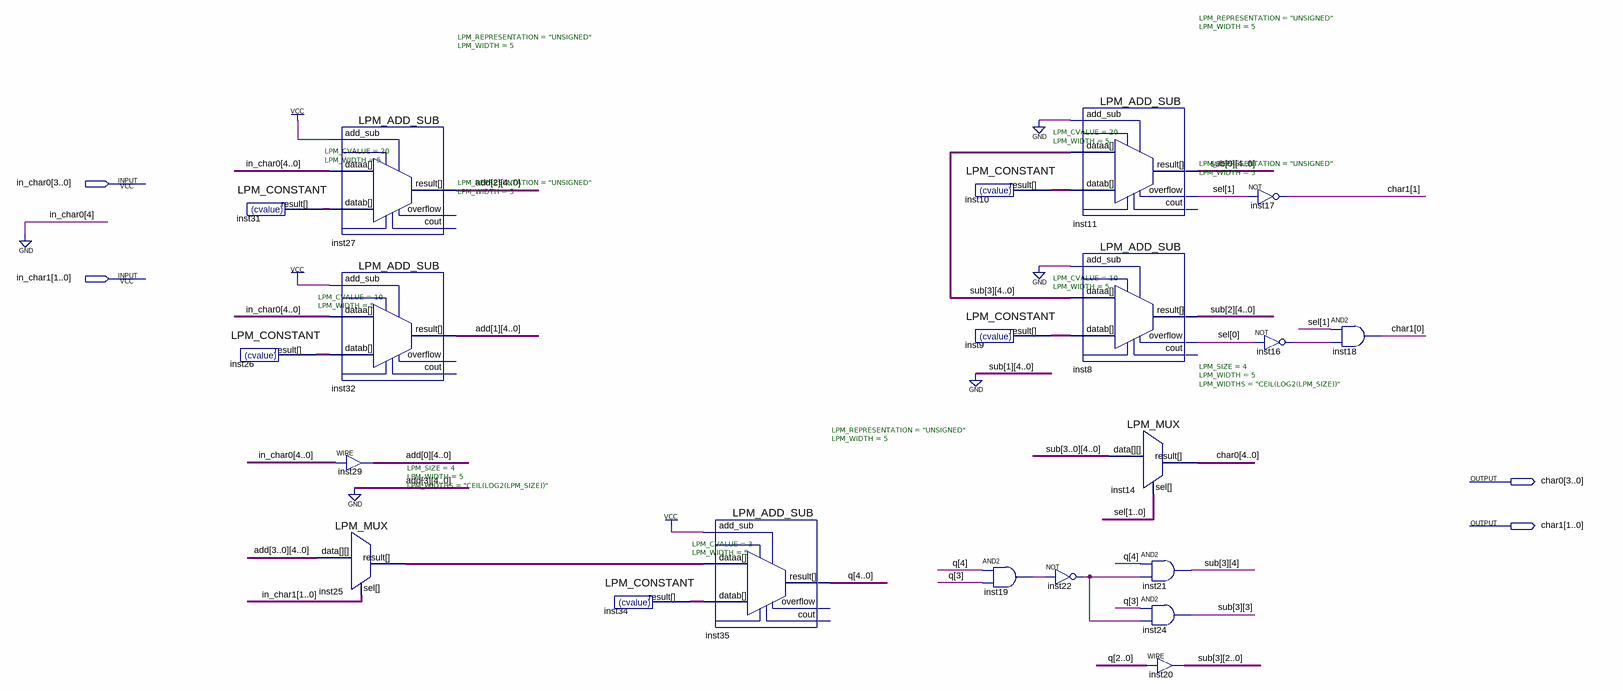
[diagram p0: schematic sheet]
// Quartus schematic add3hours.bdf as structural Verilog: 21 symbols, 4 pins
module add3hours (
  input  [3:0] in_char0,
  input  [1:0] in_char1,
  output [4:0] char0,
  output [1:0] char1
);

  wire inst16_out, inst19_out, inst22_out;
  wire [1:0] sel;
  wire [4:0] add_0, add_1, add_2, inst9_result, inst10_result, inst25_result, inst26_result, inst31_result,
       inst34_result, q, sub_0, sub_2, sub_3;

  LPM_CONSTANT #(.LPM_CVALUE(20), .LPM_WIDTH(5)) inst31 (.result(inst31_result));
  LPM_CONSTANT #(.LPM_CVALUE(10), .LPM_WIDTH(5)) inst26 (.result(inst26_result));
  LPM_MUX #(.LPM_SIZE(4), .LPM_WIDTH(5), .LPM_WIDTHS("CEIL(LOG2(LPM_SIZE))")) inst25 (
    .data({{5{1'b0}}, add_2, add_1, add_0}), .sel(in_char1), .result(inst25_result));
  LPM_ADD_SUB #(.LPM_REPRESENTATION("UNSIGNED"), .LPM_WIDTH(5)) inst27 (
    .datab(inst31_result), .add_sub(1'b1), .dataa({1'b0, in_char0}), .result(add_2));  // open: cout, overflow
  LPM_ADD_SUB #(.LPM_REPRESENTATION("UNSIGNED"), .LPM_WIDTH(5)) inst32 (
    .datab(inst26_result), .add_sub(1'b1), .dataa({1'b0, in_char0}), .result(add_1));  // open: cout, overflow
  assign add_0 = {1'b0, in_char0};  // WIRE inst29
  LPM_CONSTANT #(.LPM_CVALUE(3), .LPM_WIDTH(5)) inst34 (.result(inst34_result));
  LPM_ADD_SUB #(.LPM_REPRESENTATION("UNSIGNED"), .LPM_WIDTH(5)) inst35 (
    .datab(inst34_result), .add_sub(1'b1), .dataa(inst25_result), .result(q));  // open: cout, overflow
  LPM_CONSTANT #(.LPM_CVALUE(20), .LPM_WIDTH(5)) inst10 (.result(inst10_result));
  LPM_CONSTANT #(.LPM_CVALUE(10), .LPM_WIDTH(5)) inst9 (.result(inst9_result));
  and inst19 (inst19_out, q[4], q[3]);
  LPM_ADD_SUB #(.LPM_REPRESENTATION("UNSIGNED"), .LPM_WIDTH(5)) inst11 (
    .datab(inst10_result), .add_sub(1'b0), .dataa(sub_3), .overflow(sel[1]), .result(sub_0));  // open: cout
  LPM_ADD_SUB #(.LPM_REPRESENTATION("UNSIGNED"), .LPM_WIDTH(5)) inst8 (
    .datab(inst9_result), .add_sub(1'b0), .dataa(sub_3), .overflow(sel[0]), .result(sub_2));  // open: cout
  not inst22 (inst22_out, inst19_out);
  LPM_MUX #(.LPM_SIZE(4), .LPM_WIDTH(5), .LPM_WIDTHS("CEIL(LOG2(LPM_SIZE))")) inst14 (
    .data({sub_3, sub_2, {5{1'b0}}, sub_0}), .sel(sel), .result(char0));
  and inst21 (sub_3[4], q[4], inst22_out);
  and inst24 (sub_3[3], q[3], inst22_out);
  assign sub_3[2:0] = q[2:0];  // WIRE inst20
  not inst17 (char1[1], sel[1]);
  not inst16 (inst16_out, sel[0]);
  and inst18 (char1[0], sel[1], inst16_out);
endmodule
